# Altium schematic sheet Logic Voltage Source.SchDoc
size A4
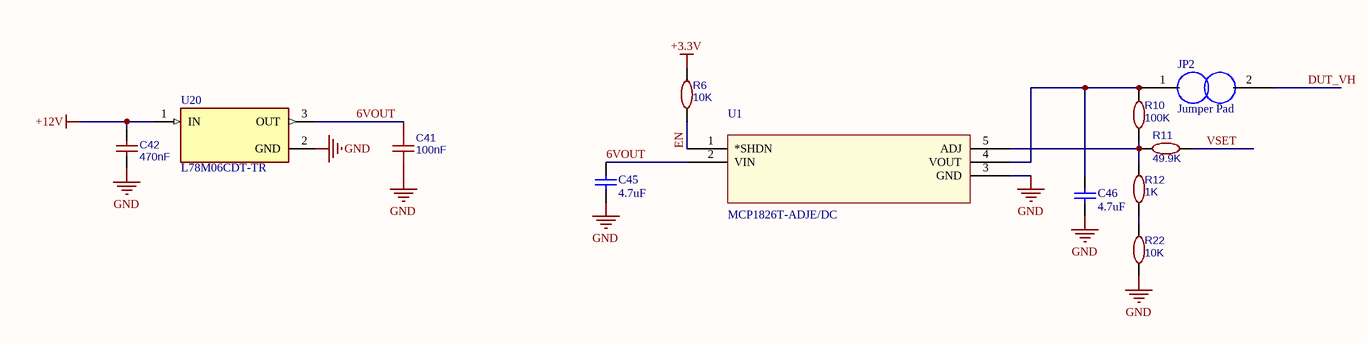
[diagram p0: Logic Voltage Source.SchDoc]

## Parts
C41  100nF  [C0603]
C42  470nF  [C0603]
C45  4.7uF  [CAPC1608X09N]
C46  4.7uF  [CAPC1608X09N]
JP2  Jumper Pad  [PCB-sjva3kmaxrqfkswkvsp7-1]
R6  10K  [R0603]
R10  100K  [R0603]
R11  49.9K  [R0603]
R12  1K  [R0603]
R22  10K  [R0603]
U1  MCP1826T-ADJE/DC  [MCP1826T-ADJE/DC]
U20  L78M06CDT-TR  [VREG_L78M06CDT-TR]

## Nets
+3.3V: R6.2
+12V: C42.2 U20.1(IN)
GND: C41.1 C42.1 C45.1 C46.1 R22.1 U1.3(GND) U20.2(GND)
6VOUT: C41.2 C45.2 U1.2(VIN) U20.3(OUT)
DUT_VH: JP2.2
EN: R6.1 U1.1(*SHDN)
VSET: R11.2
NetC46_2: C46.2 JP2.1 R10.2 U1.4(VOUT)
NetR10_1: R10.1 R11.1 R12.2 U1.5(ADJ)
NetR12_1: R12.1 R22.2

## Library data of the parts
C41 = 100nF: Manufacturer: YAGEO; Manufacture Part Number: CC0603KRX7R9BB104; nameAlias: Capacitance; SMT Type: Basic; BOM_LCSC Assembly: Yes; spicePre: C; spiceSymbolName: CC0603KRX7R9BB104; Supplier: LCSC; Supplier Part Number: C14663
C42 = 470nF: Manufacturer: WTC; Manufacture Part Number: 0603B474K100; nameAlias: Capacitance; Contributor: LCSC; Supplier: LCSC; Supplier Part Number: C123513; spicePre: C; spiceSymbolName: 0603B474K100
C45 C46 = CMP-2f55e5122ad9f092-5_3: 0603 10 nF 50 V ± 10% Tolerance X7R Surface Mount Multilayer Ceramic Capacitor; Manufacture Part Number: CL10A475KP8NNNC; Manufacturer: Samsung Electro-Mechanics; Voltage-Rated: 10V; Capacitance: 4.7uF; Package / Case: 0603; Supplier: LCSC; Supplier Part Number: C1705; Capacitance Tolerance: 10%
JP2 = CMP-75tq5o8j4p0avfd6ylbk-1: JP; CustomComponentID: 75tq5o8j4p0avfd6ylbk
R6 R22 = 10K: Manufacturer: YAGEO; Manufacture Part Number: RC0603FR-0710KL; nameAlias: Resistance (Ohms); spicePre: R; spiceSymbolName: RC0603FR-0710KL; Supplier: LCSC; Supplier Part Number: C98220
R10 = 100K: Manufacturer: UniOhm; Manufacture Part Number: 0603WAF1003T5E; nameAlias: Resistance (Ohms); SMT Type: Basic; Supplier: LCSC; BOM_LCSC Assembly: Yes; Supplier Part Number: C25803; spicePre: R; spiceSymbolName: 0603WAF1003T5E
R11 = 49.9K: Manufacturer: UniOhm; Manufacture Part Number: 0603WAF4992T5E; nameAlias: Resistance (Ohms); SMT Type: Basic; Supplier: LCSC; BOM_LCSC Assembly: Yes; Supplier Part Number: C23184; spicePre: R; spiceSymbolName: 0603WAF4992T5E
R12 = 1K: Manufacture Part Number: RC0603FR-071KL; Manufacturer: YAGEO; nameAlias: Resistance (Ohms); spicePre: R; spiceSymbolName: RC0603FR-071KL; Supplier: LCSC; Supplier Part Number: C22548
U1 = MCP1826T-ADJE/DC: Adjustable 6V 0.8V ~ 5V 400mV @ 1A SOT-223-6 Dropout Regulators(LDO) RoHS; Manufacturer: Microchip Tech; Manufacture Part Number: MCP1826T-ADJE/DC; Supplier Part Number: C147898; Supplier: LCSC
U20 = L78M06CDT-TR: Linear Voltage Regulator IC 1 Output 500mA DPAK; Manufacturer: STMicroelectronics; Manufacture Part Number: L78M06CDT-TR; Price: None; Availability: Unavailable; SnapEDA_Link: https://www.snapeda.com/parts/L78M06CDT-TR/STMicroelectronics/view-part/276899/?ref=snap; Package: TO-252 STMicroelectronics; Supplier: LCSC; Supplier Part Number: C157444